# Altium schematic sheet BUTTON_LED.SchDoc
size 420 x 297 mm; SheetNumber: 25; SheetTotal: 34
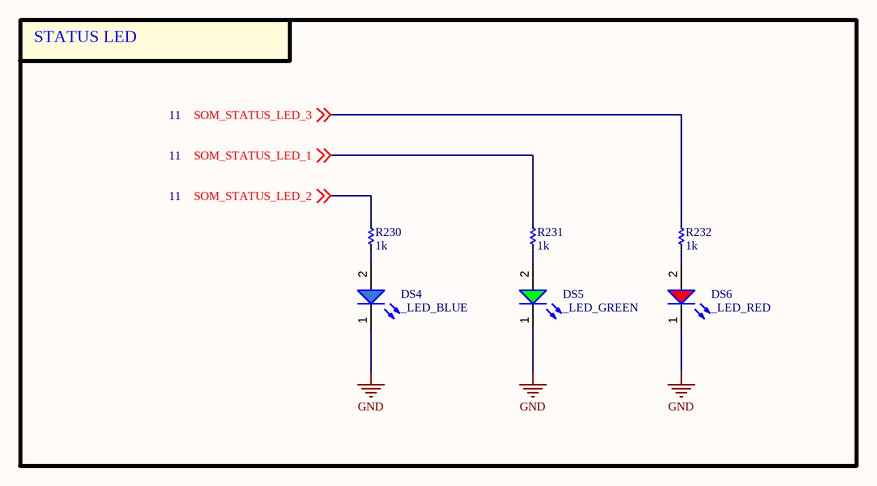
[diagram p0: BUTTON_LED.SchDoc]

## Parts
DS4  _LED_BLUE  [LED_0603]
DS5  _LED_GREEN  [LED_0603]
DS6  _LED_RED  [LED_0603]
R230  1k  [RES_C_1005x30_L]
R231  1k  [RES_C_1005x30_L]
R232  1k  [RES_C_1005x30_L]

## Blocks framed on the sheet
STATUS LED: DS4-DS6 R230-R232

## Nets
GND: DS4.1(K) DS5.1(K) DS6.1(K)
SOM_STATUS_LED_1: R231.2 ; off-sheet SOM_STATUS_LED_1
SOM_STATUS_LED_2: R230.2 ; off-sheet SOM_STATUS_LED_2
SOM_STATUS_LED_3: R232.2 ; off-sheet SOM_STATUS_LED_3
NetDS4_2: DS4.2(A) R230.1
NetDS5_2: DS5.2(A) R231.1
NetDS6_2: DS6.2(A) R232.1

## Notes on the sheet
- Project:
- Sub-system:
- Design by:
- Sheet title:
- Sheet
- of
- Checked by:
- Approved by:
- Revision:
- Document No:
- Size:
- Date:
- A3

## Library data of the parts
DS4 = LED_BLUE: LED BLUE CLEAR 0603 SMD
DS5 = LED_GREEN: LED GREEN CLEAR 0603 SMD
DS6 = LED_RED: LED RED CLEAR 0603 SMD
R230-R232 = _RES_B_2: RES